# Altium schematic sheet Connectors.SchDoc
size A
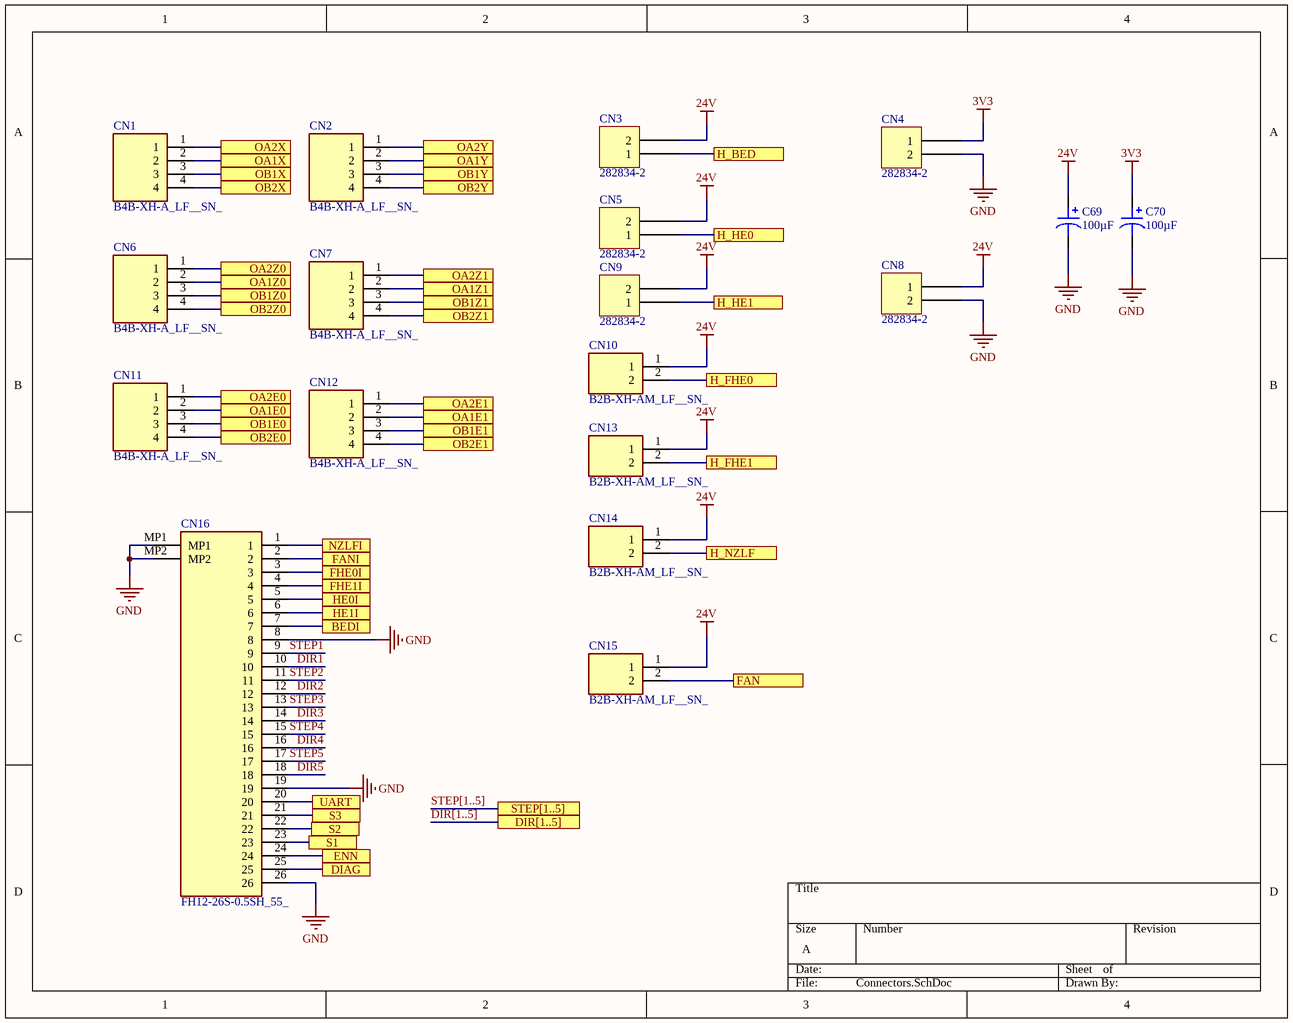
[diagram p0: Connectors.SchDoc]

## Parts
C69  100µF  [CAP ALSMD POLY 5.3MM H6.0MM]
C70  100µF  [CAP ALSMD POLY 5.3MM H6.0MM]
CN1  B4B-XH-A_LF__SN_  [B4BXHALFSN]
CN2  B4B-XH-A_LF__SN_  [B4BXHALFSN]
CN3  282834-2  [TE 282834-2]
CN4  282834-2  [TE 282834-2]
CN5  282834-2  [TE 282834-2]
CN6  B4B-XH-A_LF__SN_  [B4BXHALFSN]
CN7  B4B-XH-A_LF__SN_  [B4BXHALFSN]
CN8  282834-2  [TE 282834-2]
CN9  282834-2  [TE 282834-2]
CN10  B2B-XH-AM_LF__SN_  [B2BXHAMLFSN]
CN11  B4B-XH-A_LF__SN_  [B4BXHALFSN]
CN12  B4B-XH-A_LF__SN_  [B4BXHALFSN]
CN13  B2B-XH-AM_LF__SN_  [B2BXHAMLFSN]
CN14  B2B-XH-AM_LF__SN_  [B2BXHAMLFSN]
CN15  B2B-XH-AM_LF__SN_  [B2BXHAMLFSN]
CN16  FH12-26S-0.5SH_55_  [FH1226S05SH55]

## Ports
BEDI, DIAG, DIR[1..5], ENN, FAN, FANI, FHE0I, FHE1I, H_BED, H_FHE0, H_FHE1, H_HE0, H_HE1, H_NZLF, HE0I, HE1I, NZLFI, OA1E0, OA1E1, OA1X, OA1Y, OA1Z0, OA1Z1, OA2E0, OA2E1, OA2X, OA2Y, OA2Z0, OA2Z1, OB1E0, OB1E1, OB1X, OB1Y, OB1Z0, OB1Z1, OB2E0, OB2E1, OB2X, OB2Y, OB2Z0, OB2Z1, S1, S2, S3, STEP[1..5], UART

## Nets
3V3: C70.1 CN4.1
24V: C69.1 CN3.2 CN5.2 CN8.1 CN9.2 CN10.1 CN13.1 CN14.1 CN15.1
GND: C69.2 C70.2 CN4.2 CN8.2 CN16.8 CN16.19 CN16.26 CN16.MP1 CN16.MP2
BEDI: CN16.7 ; port BEDI
DIAG: CN16.25 ; port DIAG
DIR1: CN16.10
DIR2: CN16.12
DIR3: CN16.14
DIR4: CN16.16
DIR5: CN16.18
ENN: CN16.24 ; port ENN
FAN: CN15.2 ; port FAN
FANI: CN16.2 ; port FANI
FHE0I: CN16.3 ; port FHE0I
FHE1I: CN16.4 ; port FHE1I
H_BED: CN3.1 ; port H_BED
H_FHE0: CN10.2 ; port H_FHE0
H_FHE1: CN13.2 ; port H_FHE1
H_HE0: CN5.1 ; port H_HE0
H_HE1: CN9.1 ; port H_HE1
H_NZLF: CN14.2 ; port H_NZLF
HE0I: CN16.5 ; port HE0I
HE1I: CN16.6 ; port HE1I
NZLFI: CN16.1 ; port NZLFI
OA1E0: CN11.2 ; port OA1E0
OA1E1: CN12.2 ; port OA1E1
OA1X: CN1.2 ; port OA1X
OA1Y: CN2.2 ; port OA1Y
OA1Z0: CN6.2 ; port OA1Z0
OA1Z1: CN7.2 ; port OA1Z1
OA2E0: CN11.1 ; port OA2E0
OA2E1: CN12.1 ; port OA2E1
OA2X: CN1.1 ; port OA2X
OA2Y: CN2.1 ; port OA2Y
OA2Z0: CN6.1 ; port OA2Z0
OA2Z1: CN7.1 ; port OA2Z1
OB1E0: CN11.3 ; port OB1E0
OB1E1: CN12.3 ; port OB1E1
OB1X: CN1.3 ; port OB1X
OB1Y: CN2.3 ; port OB1Y
OB1Z0: CN6.3 ; port OB1Z0
OB1Z1: CN7.3 ; port OB1Z1
OB2E0: CN11.4 ; port OB2E0
OB2E1: CN12.4 ; port OB2E1
OB2X: CN1.4 ; port OB2X
OB2Y: CN2.4 ; port OB2Y
OB2Z0: CN6.4 ; port OB2Z0
OB2Z1: CN7.4 ; port OB2Z1
S1: CN16.23 ; port S1
S2: CN16.22 ; port S2
S3: CN16.21 ; port S3
STEP1: CN16.9
STEP2: CN16.11
STEP3: CN16.13
STEP4: CN16.15
STEP5: CN16.17
UART: CN16.20 ; port UART

## Buses and harness runs
bus DIR[1..5] = port DIR[1..5]
bus STEP[1..5] = port STEP[1..5]

## Library data of the parts
C69 C70 = 6SVPC100M: CAP ALUM POLY 100UF 20% 6.3V SMD; manufacturer: Panasonic Electronic Components; ESR (Equivalent Series Resistance): 30mOhm; Lifetime @ Temp.: 2000 Hrs @ 105°C; Ripple Current @ High Frequency: 2.15A @ 100kHz; Ripple Current @ Low Frequency: 107.5mA @ 120Hz; Surface Mount Land Size: 0.209" L x 0.209" W (5.30mm x 5.30mm); Type: Polymer; Part Number: 6SVPC100M; Applications: General Purpose; Capacitance: 100µF; componentlink1description: Datasheet; componentlink1url: https://industrial.panasonic.com/cdbs/www-data/pdf/AAB8000/AAB8000C256.pdf; componentlink2description: DigiKey Link; componentlink2url: http://digikey.com/product-detail/en/panasonic-electronic-components/6SVPC100M/P16606CT-ND/4204442; Device Package: Radial, Can - SMD; Height - Seated (Max): 0.236" (6.00mm); lastupdated: 9/2/2020 1:22:07 AM; Lifecycle Status: Active; Minimum Order: 1; Mounting Type: Surface Mount; Operating Temperature: -55°C ~ 105°C; Package / Case: Radial, Can - SMD; packaging: TapeAndReel; partid: 1943; Part Status: Active; price: 0.51; series: OS-CON™, SVPC; Size / Dimension: 0.197" Dia (5.00mm); Supplier 1: DigiKey; Supplier Part Number 1: P16606CT-ND; Tolerance: ±20%; value: 100µF; Voltage - Rated: 6.3V
CN1 CN2 CN6 CN7 CN11 CN12 = B4B-XH-A_LF__SN_: Connector; Manufacturer_Name: JST (JAPAN SOLDERLESS TERMINALS); Manufacturer_Part_Number: B4B-XH-A(LF)(SN); Datasheet Link: https://datasheet.lcsc.com/szlcsc/JST-Sales-America-B4B-XH-A-LF-SN_C144395.pdf; Height: 7mm; Arrow Part Number: B4B-XH-A(LF)(SN); Arrow Price/Stock: https://www.arrow.com/en/products/b4b-xh-a-lf-sn/jst-manufacturing?region=europe
CN3-CN5 CN8 CN9 = 282834-2: TERM BLK 2P SIDE ENT 2.54MM PCB; Manufacturer: TE Connectivity AMP Connectors; Current: 10A; Mating Orientation: Horizontal with Board; Number of Levels: 1; Pitch: 0.100" (2.54mm); Positions Per Level: 2; Voltage: 150V; Wire Gauge: 16-30 AWG; Wire Termination: Screw - Rising Cage Clamp; Part Number: 282834-2; Color: Green; ComponentLink1Description: Datasheet; ComponentLink1URL: https://www.te.com/commerce/DocumentDelivery/DDEController?Action=srchrtrv&DocNm=282834&DocType=Customer+Drawing&DocLang=English; ComponentLink2Description: DigiKey Link; ComponentLink2URL: http://digikey.com/product-detail/en/te-connectivity-amp-connectors/282834-2/A98333-ND/1150135; LastUpdated: 1/15/2020 4:15:38 AM; Lifecycle Status: Active; Minimum Order: 1; Mounting Type: Through Hole; Packaging: Bulk; Part Status: Active; Price: 0.88; Series: Buchanan; Supplier 1: DigiKey; Supplier Part Number 1: A98333-ND
CN10 CN13-CN15 = B2B-XH-AM_LF__SN_: Connector; Manufacturer_Name: JST (JAPAN SOLDERLESS TERMINALS); Manufacturer_Part_Number: B2B-XH-AM(LF)(SN); Datasheet Link: https://www.jst-mfg.com/product/pdf/eng/eXH.pdf; Height: 7mm; Arrow Part Number: B2B-XH-AM(LF)(SN); Arrow Price/Stock: https://www.arrow.com/en/products/b2b-xh-am-lf-sn/jst-manufacturing?region=europe
CN16 = FH12-26S-0.5SH_55_: Connector; Manufacturer_Name: Hirose; Manufacturer_Part_Number: FH12-26S-0.5SH(55); Datasheet Link: https://datasheet.datasheetarchive.com/originals/distributors/SFDatasheet-1/sf-00023459.pdf; Height: 2.2mm; Mouser Part Number: 798-FH12-26S-0.5SH55; Mouser Price/Stock: https://www.mouser.co.uk/ProductDetail/Hirose-Connector/FH12-26S-0.5SH55?qs=Ux3WWAnHpjC%2FipJJsmJDaQ%3D%3D; Arrow Part Number: FH12-26S-0.5SH(55); Arrow Price/Stock: https://www.arrow.com/en/products/fh12-26s-0.5sh-55/hirose-electric